# EasyEDA schematic LcsNodes-Building-Block-Power-Module-L6205.json
TITLE: Power Module L6205; REV: 1.0; Date: 2022-09-19; Sheet: 1/1; Drawn By: helmut-f; Company: Your Company
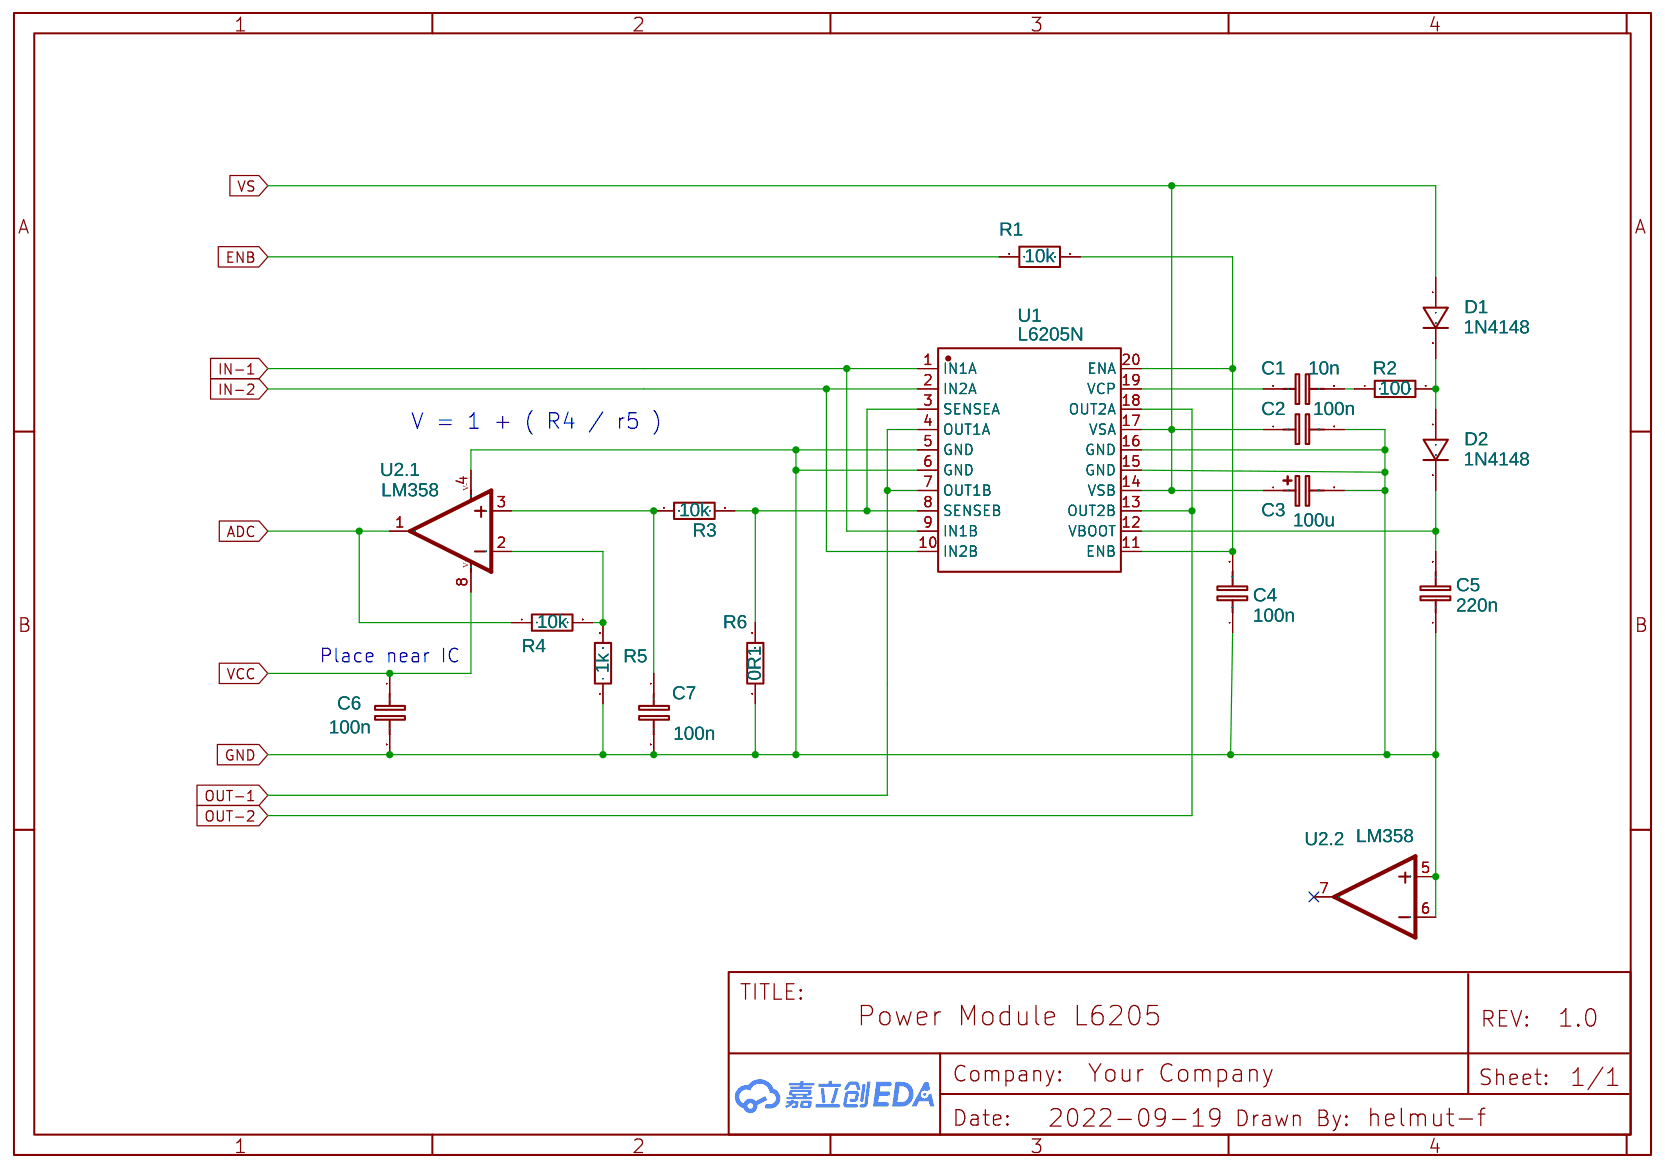
[diagram p0: schematic sheet]

## Parts
C1  10n  [RAD-0.2]
C2  100n  [RAD-0.2]
C3  100u  [CASE-E_7343]
C4  100n  [RAD-0.2]
C5  220n  [RAD-0.2]
C6  100n  [RAD-0.2]
C7  100n  [RAD-0.2]
D1  1N4148  [DO-35_BD2.0-L4.0-P8.00-D0.5-FD]
D2  1N4148  [DO-35_BD2.0-L4.0-P8.00-D0.5-FD]
R1  10k  [R_AXIAL-0.3]
R2  100  [AXIAL-0.1]
R3  10k  [AXIAL-0.1]
R4  10k  [AXIAL-0.1]
R5  1k  [AXIAL-0.1]
R6  0R1  [L_AXIAL-0.5]
U1  L6205N  [PDIP-20_L24.5-W7.3-P2.54-LS7.9-BL]
U2  LM358  [DIP08-KIT]  (sections 1,2)

## Library data of the parts
C1 C4 C5 = C_0603_EU: Contributor: LCEDA_Lib
C2 C6 C7 = C_0603_EU: Contributor: LCEDA_Lib; Package Display: No
C3 = C_Tan_SMD_E_EU: Contributor: LCEDA_Lib
D1 D2 = 1N4148: Supplier: LCSC; Manufacturer: SEMTECH; Supplier Part: C14516; Contributor: LCEDA_Lib
R1 = R_AXIAL-0.3_EU: Contributor: LCEDA_Lib
R2-R5 = RESISTOR-AXIAL-0.1
R6 = RESISTOR-AXIAL-0.1: Package Display: No
U1 = L6205N: Supplier: LCSC; Supplier Part: C962260; Manufacturer: STMicroelectronics; Contributor: LCSC
U2 = LM358: Contributor: SparkFun; subpart_no: 1

## Nets
GND: C2.2 C3.2 C4.1 C5.1 C6.2 C7.2 R5.1 R6.1 U1.5(GND) U1.6(GND) U1.15(GND) U1.16(GND) U2.4(V-) U2.5(+IN) U2.6(-IN)
VCC: C6.1 U2.8(V+)
ADC: R4.1 U2.1(OUT)
ENB: R1.1
IN-1: U1.1(IN1A) U1.9(IN1B)
IN-2: U1.2(IN2A) U1.10(IN2B)
OUT-1: U1.4(OUT1A) U1.7(OUT1B)
OUT-2: U1.13(OUT2B) U1.18(OUT2A)
VS: C2.1 C3.1 D1.1 U1.14(VSB) U1.17(VSA)
Net-(C1-1): C1.1 U1.19(VCP)
Net-(C1-2): C1.2 R2.1
Net-(C4-2): C4.2 R1.2 U1.11(ENB) U1.20(ENA)
Net-(C5-2): C5.2 D2.2 U1.12(VBOOT)
Net-(C7-1): C7.1 R3.1 U2.3(+IN)
Net-(D1-2): D1.2 D2.1 R2.2
Net-(R3-2): R3.2 R6.2 U1.3(SENSEA) U1.8(SENSEB)
Net-(R4-2): R4.2 R5.2 U2.2(-IN)

Not connected (* = marked no-connect by the designer): U2 7(OUT)*

## Notes on the sheet
- V = 1 + ( R4 / r5 )
- Place near IC
